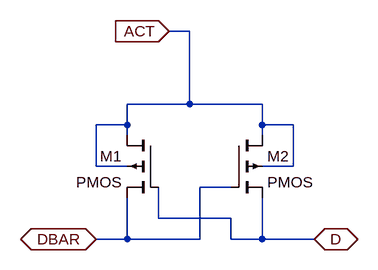
[diagram p0: schematic PSenseAmp.asc]
PSenseAmp.asc, the LTspice schematic file:
Version 4
SHEET 1 1364 720
WIRE 192 -96 160 -96
WIRE 192 16 192 -96
WIRE 192 16 96 16
WIRE 304 16 192 16
WIRE 96 48 96 16
WIRE 96 48 48 48
WIRE 304 48 304 16
WIRE 352 48 304 48
WIRE 96 64 96 48
WIRE 304 64 304 48
WIRE 48 112 48 48
WIRE 96 112 48 112
WIRE 352 112 352 48
WIRE 352 112 304 112
WIRE 256 144 208 144
WIRE 144 192 144 144
WIRE 256 192 144 192
WIRE 96 224 96 160
WIRE 96 224 48 224
WIRE 208 224 208 144
WIRE 208 224 96 224
WIRE 256 224 256 192
WIRE 304 224 304 160
WIRE 304 224 256 224
WIRE 384 224 304 224
FLAG 160 -96 ACT
IOPIN 160 -96 In
FLAG 48 224 DBAR
IOPIN 48 224 BiDir
FLAG 384 224 D
IOPIN 384 224 BiDir
SYMBOL pmos4 144 64 M0
SYMATTR InstName M1
SYMATTR Value2 l=0.6u w=3.6u
SYMBOL pmos4 256 64 R0
SYMATTR InstName M2
SYMATTR Value2 l=0.6u w=3.6u

The netlist it stands for:
* PSenseAmp.asc
M1 ACT D DBAR ACT PMOS l=0.6u w=3.6u
M2 ACT DBAR D ACT PMOS l=0.6u w=3.6u
.model NMOS NMOS
.model PMOS PMOS
.lib standard.mos
.backanno
.end